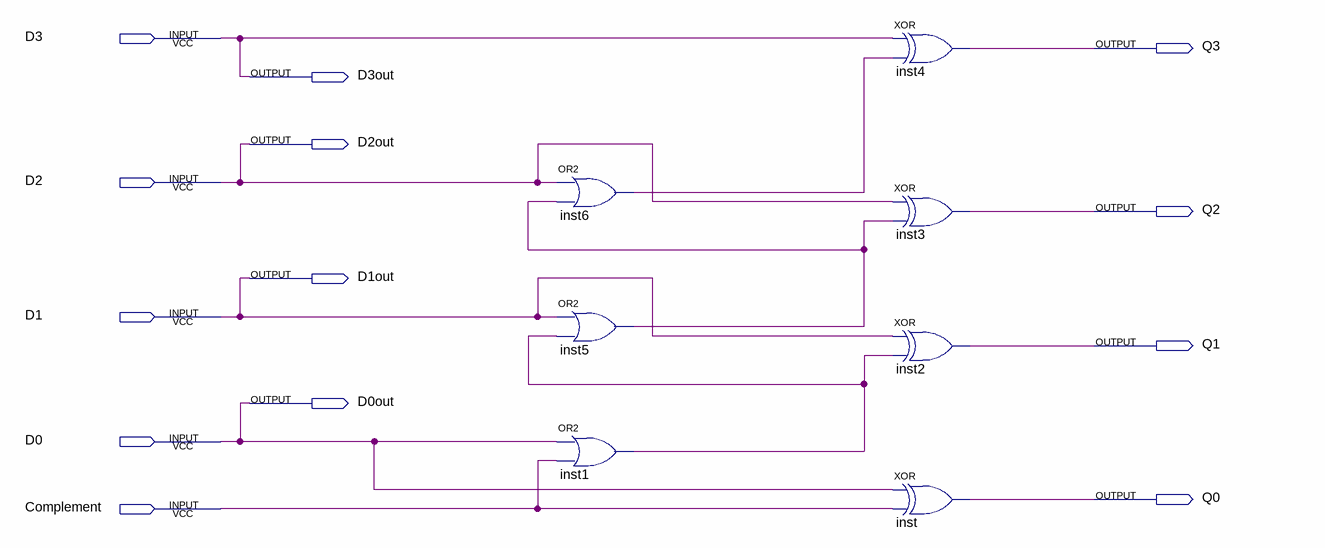
[diagram p0: schematic sheet]
// Quartus schematic Lab5.bdf as structural Verilog: 7 symbols, 13 pins
module Lab5 (
  input  D3,
  input  D2,
  input  D1,
  input  D0,
  input  Complement,
  output Q3,
  output D3out,
  output D2out,
  output Q2,
  output D1out,
  output Q1,
  output D0out,
  output Q0
);

  wire inst1_out, inst5_out, inst6_out;

  or inst6 (inst6_out, D2, inst5_out);
  or inst5 (inst5_out, D1, inst1_out);
  or inst1 (inst1_out, D0, Complement);
  xor inst4 (Q3, D3, inst6_out);
  xor inst3 (Q2, D2, inst5_out);
  xor inst2 (Q1, D1, inst1_out);
  xor inst (Q0, D0, Complement);

  assign D0out = D0;
  assign D1out = D1;
  assign D2out = D2;
  assign D3out = D3;
endmodule
